# EAGLE design arpie_control_surface (EAGLE 5.10)
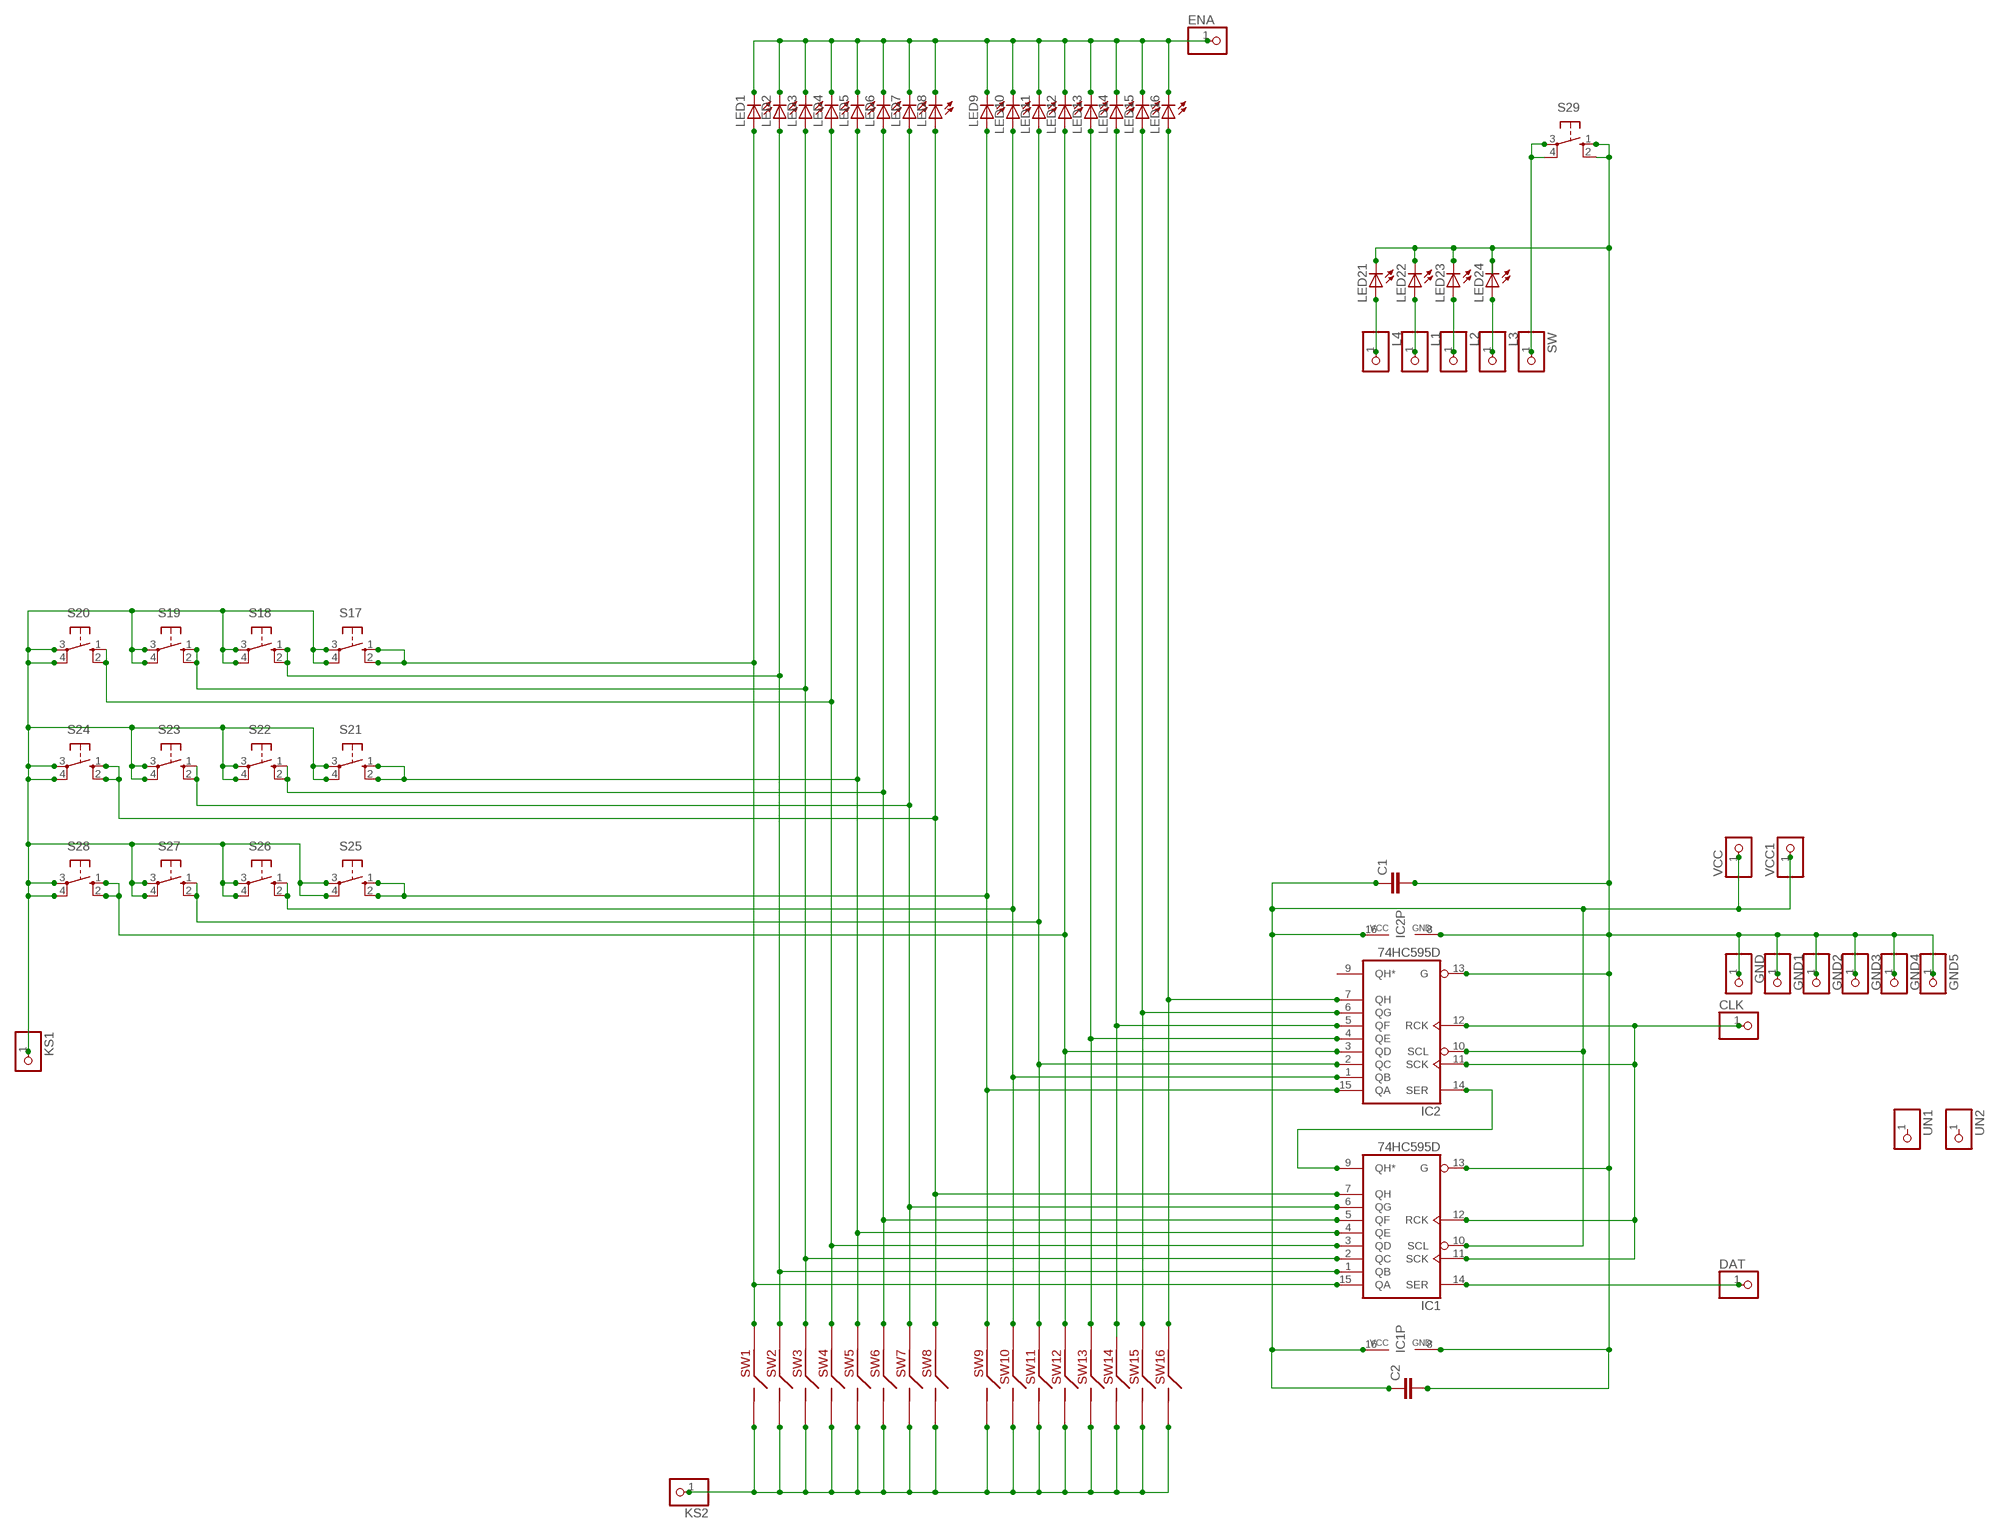
[diagram p0: schematic, sheet 1]

## Parts
C1  C-EUC0805  [C0805]
C2  C-EUC0805  [C0805]
CLK  PINHD-1X1  [1X01]
DAT  PINHD-1X1  [1X01]
ENA  PINHD-1X1  [1X01]
GND  PINHD-1X1  [1X01]
GND1  PINHD-1X1  [1X01]
GND2  PINHD-1X1  [1X01]
GND3  PINHD-1X1  [1X01]
GND4  PINHD-1X1  [1X01]
GND5  PINHD-1X1  [1X01]
IC1  74HC595D  [SO16]
IC2  74HC595D  [SO16]
KS1  PINHD-1X1  [1X01]
KS2  PINHD-1X1  [1X01]
L1  PINHD-1X1  [1X01]
L2  PINHD-1X1  [1X01]
L3  PINHD-1X1  [1X01]
L4  PINHD-1X1  [1X01]
LED1  LED3MM  [LED3MM]
LED2  LED3MM  [LED3MM]
LED3  LED3MM  [LED3MM]
LED4  LED3MM  [LED3MM]
LED5  LED3MM  [LED3MM]
LED6  LED3MM  [LED3MM]
LED7  LED3MM  [LED3MM]
LED8  LED3MM  [LED3MM]
LED9  LED3MM  [LED3MM]
LED10  LED3MM  [LED3MM]
LED11  LED3MM  [LED3MM]
LED12  LED3MM  [LED3MM]
LED13  LED3MM  [LED3MM]
LED14  LED3MM  [LED3MM]
LED15  LED3MM  [LED3MM]
LED16  LED3MM  [LED3MM]
LED21  LED3MM  [LED3MM]
LED22  LED3MM  [LED3MM]
LED23  LED3MM  [LED3MM]
LED24  LED3MM  [LED3MM]
S17  10-XX  [B3F-10XX]
S18  10-XX  [B3F-10XX]
S19  10-XX  [B3F-10XX]
S20  10-XX  [B3F-10XX]
S21  10-XX  [B3F-10XX]
S22  10-XX  [B3F-10XX]
S23  10-XX  [B3F-10XX]
S24  10-XX  [B3F-10XX]
S25  10-XX  [B3F-10XX]
S26  10-XX  [B3F-10XX]
S27  10-XX  [B3F-10XX]
S28  10-XX  [B3F-10XX]
S29  10-XX  [B3F-10XX]
SW  PINHD-1X1  [1X01]
SW1  3MMTACTSW  [3MMTACTSW]
SW2  3MMTACTSW  [3MMTACTSW]
SW3  3MMTACTSW  [3MMTACTSW]
SW4  3MMTACTSW  [3MMTACTSW]
SW5  3MMTACTSW  [3MMTACTSW]
SW6  3MMTACTSW  [3MMTACTSW]
SW7  3MMTACTSW  [3MMTACTSW]
SW8  3MMTACTSW  [3MMTACTSW]
SW9  3MMTACTSW  [3MMTACTSW]
SW10  3MMTACTSW  [3MMTACTSW]
SW11  3MMTACTSW  [3MMTACTSW]
SW12  3MMTACTSW  [3MMTACTSW]
SW13  3MMTACTSW  [3MMTACTSW]
SW14  3MMTACTSW  [3MMTACTSW]
SW15  3MMTACTSW  [3MMTACTSW]
SW16  3MMTACTSW  [3MMTACTSW]
UN1  PINHD-1X1  [1X01]
UN2  PINHD-1X1  [1X01]
VCC  PINHD-1X1  [1X01]
VCC1  PINHD-1X1  [1X01]

## Nets
DAT: DAT.1 IC1.14(SER)
GND: C1.2 C2.2 GND1.1 GND2.1 GND3.1 GND4.1 GND5.1 GND.1 IC1.8(GND) IC1.13(G) IC2.8(GND) IC2.13(G) LED21.K(C) LED22.K(C) LED23.K(C) LED24.K(C) S29.1(S) S29.2(S1)
KEY_SCAN1: KS1.1 S17.3(P) S17.4(P1) S18.3(P) S18.4(P1) S19.3(P) S19.4(P1) S20.3(P) S20.4(P1) S21.3(P) S21.4(P1) S22.3(P) S22.4(P1) S23.3(P) S23.4(P1) S24.3(P) S24.4(P1) S25.3(P) S25.4(P1) S26.3(P) S26.4(P1) S27.3(P) S27.4(P1) S28.3(P) S28.4(P1)
KEY_SCAN2: KS2.1 SW1.P$2 SW2.P$2 SW3.P$2 SW4.P$2 SW5.P$2 SW6.P$2 SW7.P$2 SW8.P$2 SW9.P$2 SW10.P$2 SW11.P$2 SW12.P$2 SW13.P$2 SW14.P$2 SW15.P$2 SW16.P$2
LED1: L1.1 LED22.A
LED2: L2.1 LED23.A
LED3: L3.1 LED24.A
LED4: L4.1 LED21.A
LEDS_ENABLE: ENA.1 LED1.K(C) LED2.K(C) LED3.K(C) LED4.K(C) LED5.K(C) LED6.K(C) LED7.K(C) LED8.K(C) LED9.K(C) LED10.K(C) LED11.K(C) LED12.K(C) LED13.K(C) LED14.K(C) LED15.K(C) LED16.K(C)
N$1: IC1.15(QA) LED1.A S17.1(S) S17.2(S1) SW1.P$1
N$2: IC1.1(QB) LED2.A S18.1(S) S18.2(S1) SW2.P$1
N$3: IC1.2(QC) LED3.A S19.1(S) S19.2(S1) SW3.P$1
N$4: IC1.3(QD) LED4.A S20.1(S) S20.2(S1) SW4.P$1
N$5: IC1.4(QE) LED5.A S21.1(S) S21.2(S1) SW5.P$1
N$6: IC1.5(QF) LED6.A S22.1(S) S22.2(S1) SW6.P$1
N$7: IC1.6(QG) LED7.A S23.1(S) S23.2(S1) SW7.P$1
N$8: IC1.7(QH) LED8.A S24.1(S) S24.2(S1) SW8.P$1
N$9: IC2.15(QA) LED9.A S25.1(S) S25.2(S1) SW9.P$1
N$12: IC2.1(QB) LED10.A S26.1(S) S26.2(S1) SW10.P$1
N$28: IC2.3(QD) LED12.A S28.1(S) S28.2(S1) SW12.P$1
N$30: IC1.9(QH*) IC2.14(SER)
N$35: IC2.4(QE) LED13.A SW13.P$1
N$36: IC2.2(QC) LED11.A S27.1(S) S27.2(S1) SW11.P$1
N$37: IC2.5(QF) LED14.A SW14.P$1
N$38: IC2.6(QG) LED15.A SW15.P$1
N$39: IC2.7(QH) LED16.A SW16.P$1
SCK: CLK.1 IC1.11(SCK) IC1.12(RCK) IC2.11(SCK) IC2.12(RCK)
SWITCH1: S29.3(P) S29.4(P1) SW.1
VCC: C1.1 C2.1 IC1.10(SCL) IC1.16(VCC) IC2.10(SCL) IC2.16(VCC) VCC1.1 VCC.1
Unconnected: IC2.9(QH*) UN1.1 UN2.1

## Library data of the parts
C1 C2 = rcl:C-EU: CAPACITOR, European symbol
CLK DAT ENA GND GND1-GND5 KS1 KS2 L1-L4 SW UN1 UN2 VCC VCC1 = adafruit:PINHD-1X1: Pin header 1x1 for 0.1" spacing With round pins
IC1 IC2 = 74xx-eu:74*595: 8-bit SHIFT REGISTER, output latch
LED1-LED16 LED21-LED24 = adafruit:LED: LED OSRAM: - CHIPLED LG R971, LG N971, LY N971, LG Q971, LY Q971, LO R971, LY R971 LH N974, LH R974 LS Q976, LO Q976, LY Q976 LO Q996 - Hyper CHIPLED LW Q18S LB Q993, LB Q99A, LB R99A - SideLED LS A670, LO A670, LY A670, LG A670, LP A670 LB A673, LV A673, LT A673, LW A673 LH A674 LY A675 LS A676, LA A676, LO A676, LY A676, LW A676 LS A679, LY A679, LG A679 - Hyper Micro SIDELED® LS Y876, LA Y876, LO Y876, LY Y876 LT Y87S - SmartLED LW L88C, LW L88S LB L89C, LB L89S, LG L890 LS L89K, LO L89K, LY L89K LS L896, LA L896, LO L896, LY L896 - TOPLED LS T670, LO T670, LY T670, LG T670, LP T670 LSG T670, LSP T670, LSY T670, LOP T670, LYG T670 LG T671, LOG T671, LSG T671 LB T673, LV T673, LT T673, LW T673 LH T674 LS T676, LA T676, LO T676, LY T676, LB T676, LH T676, LSB T676, LW T676 LB T67C, LV T67C, LT T67C, LS T67K, LO T67K, LY T67K, LW E67C LS E67B, LA E67B, LO E67B, LY E67B, LB E67C, LV E67C, LT E67C LW T67C LS T679, LY T679, LG T679 LS T770, LO T770, LY T770, LG T770, LP T770 LB T773, LV T773, LT T773, LW T773 LH T774 LS E675, LA E675, LY E675, LS T675 LS T776, LA T776, LO T776, LY T776, LB T776 LHGB T686 LT T68C, LB T68C - Hyper Mini TOPLED® LB M676 - Mini TOPLED Santana® LG M470 LS M47K, LO M47K, LY M47K Source: http://www.osram.convergy.de/
S17-S29 = switch-omron:10-XX: OMRON SWITCH
SW1-SW16 = jasons_stuff:3MMTACTSW

## Board
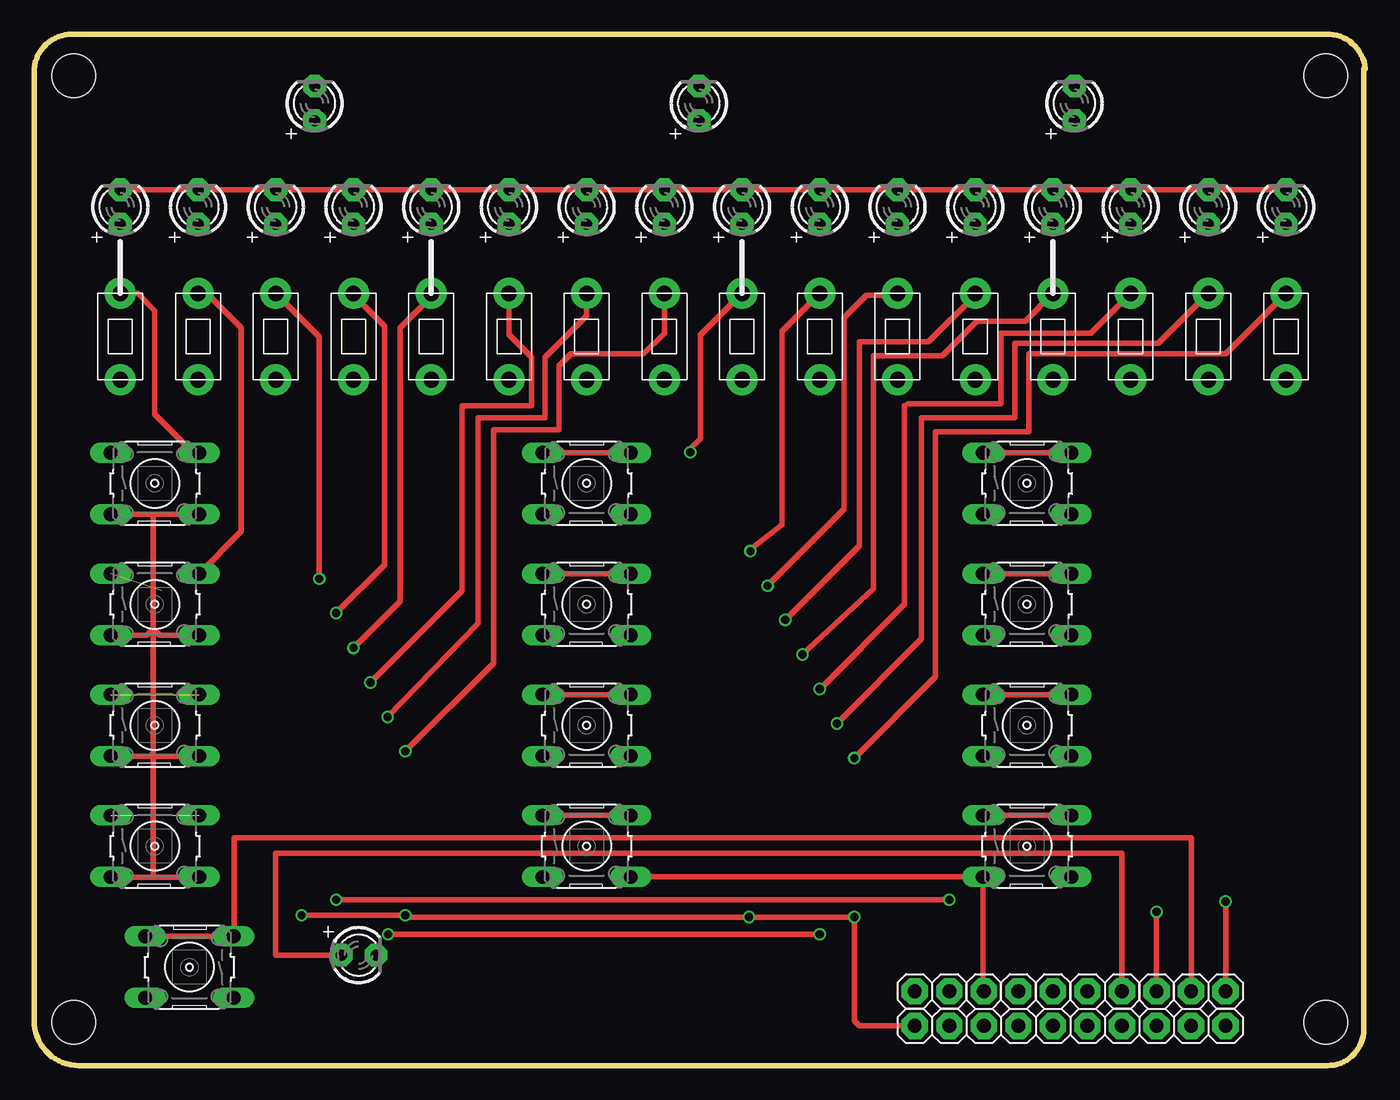
[diagram p1: board, top side]
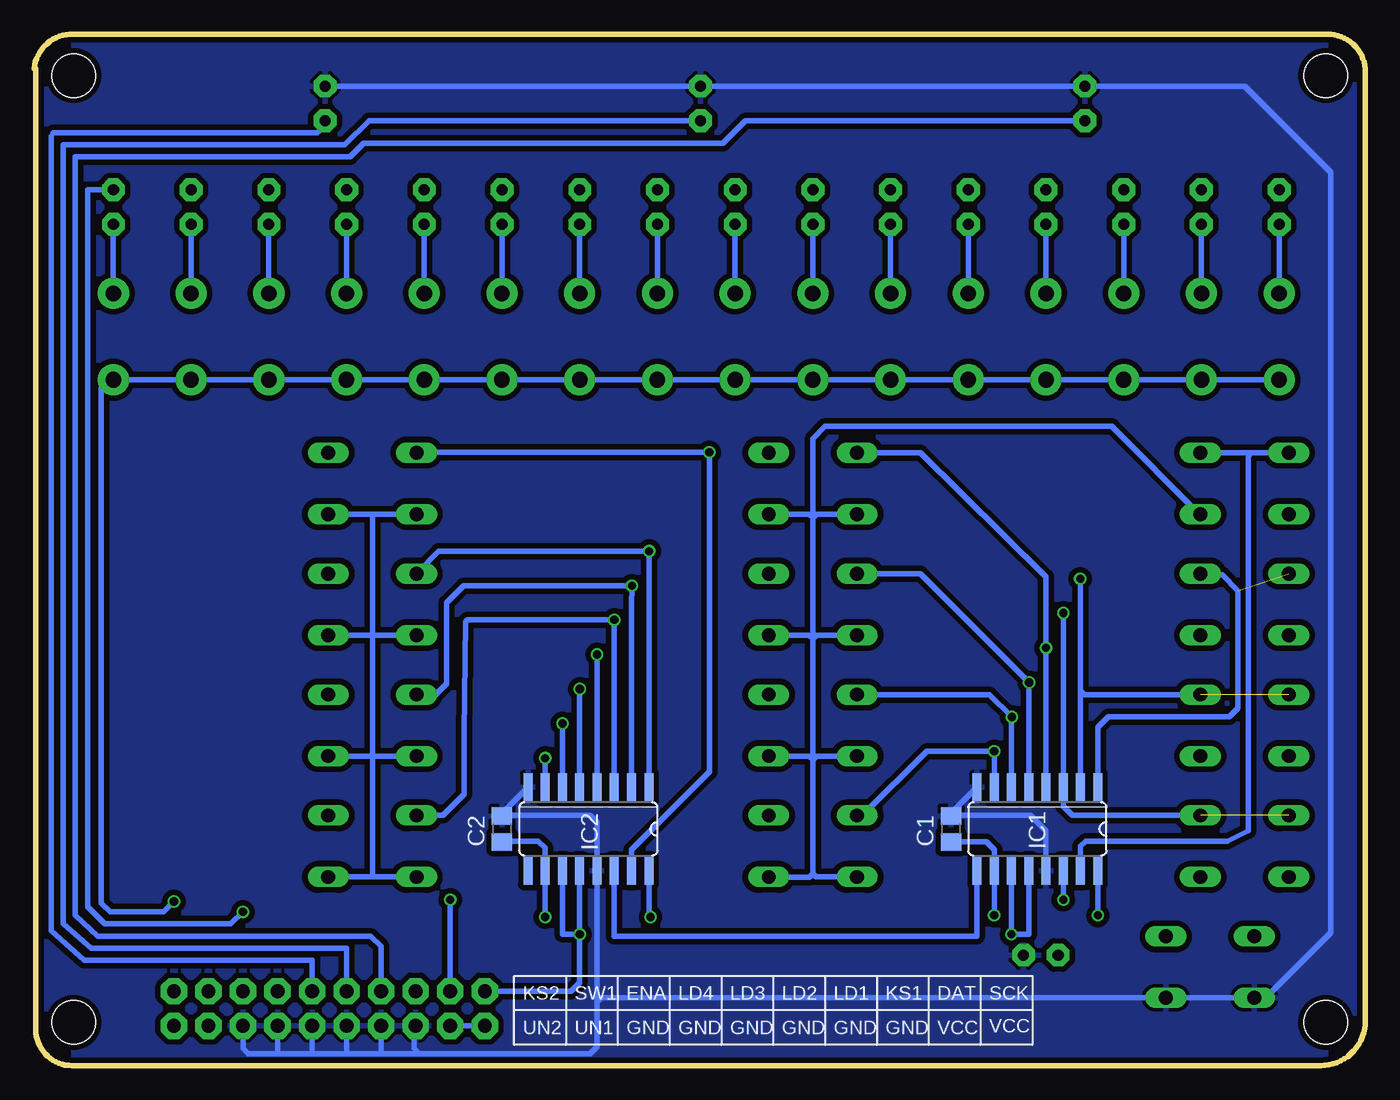
[diagram p2: board, bottom side, seen from below]

Size 97.92 x 75.84 mm. Coordinates in mm from the lower left corner, seen from the top.
Outline: 97.92,73.28 arc90 94.74,75.82 2.79,75.82 arc90 0,73.03 0,3.3 arc90 3.3,0 95.12,0 arc90 97.79,2.67 97.79,73.28
Copper layers (1*16): Top 0.035mm / dielectric 1.5mm / Bottom 0.035mm
Design rules "ITEADstudio_DRC": minimum track width 6mil, minimum drill 12mil, track to track 6mil, track to pad 6mil, pad to pad 6mil, via to via 6mil, smd to smd 0mil, copper to edge 10mil, drill to drill 10mil, minimum pad ring 10mil, minimum via ring 6mil, stop-mask expansion 2mil, vias tented up to drill 100mil, thermal gap 10mil
Holes 3.2 mm at 2.92,72.77 2.92,3.17 95,72.77 95,3.17

### Footprints (pad centres in the part's own frame; a part is rotated, then mirrored left to right if it is on the bottom)
C0805 = smd 1.3 x 1.5: 1 -0.95,0; 2 0.95,0
1X01 = drill 1.016 pad 1.93 octagon: 1 0,0
SO16 = smd 0.66 x 2.032: 1 -4.445,-3.073; 2 -3.175,-3.073; 3 -1.905,-3.073; 4 -0.635,-3.073; 5 0.635,-3.073; 6 1.905,-3.073; 7 3.175,-3.073; 8 4.445,-3.073; 9 4.445,3.073; 10 3.175,3.073; 11 1.905,3.073; 12 0.635,3.073; 13 -0.635,3.073; 14 -1.905,3.073; 15 -3.175,3.073; 16 -4.445,3.073
LED3MM = drill 0.813 pad 1.676 octagon: A -1.27,0; K 1.27,0
B3F-10XX = drill 1.016 long: 1 -3.251,2.261; 2 3.251,2.261; 3 -3.251,-2.261; 4 3.251,-2.261
3MMTACTSW = drill 1.143 pad 2.286 round: P$1 0,2.54; P$2 0,-3.81

### Placement (x,y rotation side)
C1  30.48,17.4 90 bottom
C2  63.5,17.4 90 bottom
CLK  64.77,5.46 0 top
DAT  67.31,5.46 0 top
ENA  82.55,5.46 90 top
GND  80.01,2.92 0 top
GND1  82.55,2.92 0 top
GND2  77.47,2.92 0 top
GND3  74.93,2.92 0 top
GND4  72.39,2.92 0 top
GND5  69.85,2.92 0 top
IC1  24.13,17.4 180 bottom
IC2  57.15,17.4 180 bottom
KS1  69.85,5.46 90 top
KS2  87.63,5.46 0 top
L1  72.39,5.46 90 top
L2  74.93,5.46 90 top
L3  77.47,5.46 90 top
L4  80.01,5.46 0 top
LED1  6.35,63.12 90 top
LED2  12.06,63.12 90 top
LED3  17.78,63.12 90 top
LED4  23.5,63.12 90 top
LED5  29.21,63.12 90 top
LED6  34.93,63.12 90 top
LED7  40.64,63.12 90 top
LED8  46.36,63.12 90 top
LED9  52.07,63.12 90 top
LED10  57.79,63.12 90 top
LED11  63.5,63.12 90 top
LED12  69.21,63.12 90 top
LED13  74.93,63.12 90 top
LED14  80.64,63.12 90 top
LED15  86.36,63.12 90 top
LED16  92.08,63.12 90 top
LED21  23.88,8.13 0 top
LED22  20.64,70.74 90 top
LED23  48.9,70.74 90 top
LED24  76.52,70.74 90 top
S17  8.89,42.8 0 top
S18  8.89,33.91 0 top
S19  8.89,25.02 0 top
S20  8.89,16.13 0 top
S21  40.64,42.8 0 top
S22  40.64,33.91 0 top
S23  40.64,25.02 0 top
S24  40.64,16.13 0 top
S25  73.02,42.8 0 top
S26  73.02,33.91 0 top
S27  73.02,25.02 0 top
S28  73.02,16.13 0 top
S29  11.43,7.24 180 top
SW  85.09,5.46 90 top
SW1  6.35,54.23 0 top
SW2  12.06,54.23 0 top
SW3  17.78,54.23 0 top
SW4  23.5,54.23 0 top
SW5  29.21,54.23 0 top
SW6  34.93,54.23 0 top
SW7  40.64,54.23 0 top
SW8  46.36,54.23 0 top
SW9  52.07,54.23 0 top
SW10  57.79,54.23 0 top
SW11  63.5,54.23 0 top
SW12  69.21,54.23 0 top
SW13  74.93,54.23 0 top
SW14  80.64,54.23 0 top
SW15  86.36,54.23 0 top
SW16  92.08,54.23 0 top
UN1  85.09,2.92 0 top
UN2  87.63,2.92 0 top
VCC  64.77,2.92 0 top
VCC1  67.31,2.92 0 top

### Tracks (layer width: path | path; a pad name or v marks a point on that pad's centre or on a via)
DAT  (via drill 0.6)
  Top 0.406: v22.22,12.19 v67.31,12.19
  Bottom 0.406: v22.22,12.19 IC1.14 | v67.31,12.19 DAT.1
GND
  Bottom 0.406: LED24.K LED23.K LED22.K 8.89,72.01 2.54,65.66 2.54,9.78 7.62,4.7 7.9,4.7 S29.2 S29.1 56.24,4.98 56.52,4.7 | 30.41,18.41 C1.2 | 30.41,18.41 24.64,18.41 23.5,17.27 IC1.13 | 30.41,18.41 30.41,18.63 IC1.8 | IC2.8 63.5,18.57 C2.2 63.43,18.41 57.02,18.41 56.52,17.91 IC2.13 56.52,4.7 | 69.6,0.89 57.02,0.89 56.52,1.4 56.52,4.7 | GND5.1 69.98,2.79 69.98,1.27 69.6,0.89 | 69.6,0.89 72.39,0.89 | 72.39,0.89 74.93,0.89 | 74.93,0.89 77.47,0.89 | 77.47,0.89 80.01,0.89 | 80.01,0.89 82.17,0.89 82.55,1.27 GND1.1 | 80.01,0.89 GND.1 | 77.47,0.89 GND2.1 | 74.93,0.89 GND3.1 | 72.39,0.89 GND4.1
  pour Bottom (isolate 0.406): 2.92,0.51 95,0.51 95,3.05 97.28,3.05 97.28,3.17 97.41,3.17 97.41,72.77 95,72.77 95,75.31 2.92,75.31 2.92,72.77 0.51,72.77 0.51,3.17 2.92,3.17
KEY_SCAN1
  Top 0.406: S17.3 S17.4 8.79,40.54 8.76,40.51 8.76,32.13 | 8.76,13.84 8.76,22.61 | 8.76,22.61 8.76,22.99 | 8.76,22.99 8.76,32.13 | 8.76,13.84 5.66,13.84 S20.3 | 8.76,13.84 12.12,13.84 S20.4 | S19.3 8.53,22.76 8.76,22.99 | S19.4 8.91,22.76 8.76,22.61 | S18.3 8.28,31.65 8.76,32.13 | S18.4 9.25,31.65 8.76,32.13 | S24.4 S28.3 69.77,5.54 KS1.1
  Bottom 0.406: S17.4 12.22,40.54 18.67,46.99 39.75,46.99 40.64,46.1 40.64,40.26 | S25.3 S25.4 73.05,40.54 73.02,40.51 73.02,31.75 | 73.02,31.65 S26.3 | 73.02,31.65 S26.4 73.13,31.65 73.02,31.75 | 73.15,22.76 S27.3 | 73.15,22.76 S27.4 73.05,22.76 73.02,22.73 73.02,14 72.9,13.87 | S28.3 72.9,13.87 | 72.9,13.87 S28.4 | 73.02,31.65 73.02,31.75 | 73.02,31.65 73.02,22.88 73.15,22.76 | 40.64,40.26 40.64,31.37 | 40.64,31.37 40.64,22.48 | 40.64,22.48 40.64,14.1 | 40.64,14.1 40.89,13.84 43.87,13.84 S24.4 | S24.3 40.41,13.87 40.64,14.1 | S23.3 40.36,22.76 40.64,22.48 | S23.4 40.92,22.76 40.64,22.48 | S22.3 40.36,31.65 40.64,31.37 | S22.4 40.92,31.65 40.64,31.37 | S21.3 40.36,40.54 40.64,40.26 | S21.4 40.92,40.54 40.64,40.26
KEY_SCAN2  (via drill 0.6)
  Top 0.406: v87.63,12.07 KS2.1
  Bottom 0.406: SW1.P$2 SW2.P$2 SW3.P$2 SW4.P$2 SW5.P$2 SW6.P$2 SW7.P$2 SW8.P$2 SW9.P$2 SW10.P$2 SW11.P$2 SW12.P$2 SW13.P$2 SW14.P$2 SW15.P$2 | SW15.P$2 SW16.P$2 | SW15.P$2 92.2,50.42 92.33,50.29 | SW15.P$2 92.33,50.42 92.96,49.78 92.96,11.94 92.33,11.3 88.39,11.3 v87.63,12.07
LED1
  Bottom 0.406: LED22.A 45.59,69.47 47.24,67.82 73.66,67.82 74.68,66.8 94.87,66.8 94.87,11.05 93.22,9.52 73.15,9.52 72.39,8.76 L1.1
LED2
  Bottom 0.406: LED23.A 73.28,69.47 75.06,67.69 95.76,67.69 95.76,10.41 93.73,8.64 74.93,8.64 L2.1
LED3
  Bottom 0.406: LED24.A 76.52,69.02 77.09,68.58 96.52,68.58 96.65,68.33 96.65,9.91 94.23,7.75 77.47,7.75 L3.1
LED4
  Top 0.406: L4.1 80.01,15.62 17.78,15.62 17.75,8.13 LED21.A
LEDS_ENABLE  (via drill 0.6)
  Top 0.406: LED1.K LED2.K LED3.K | LED3.K 19.05,64.39 | LED4.K 24.13,64.39 | LED3.K LED4.K | LED4.K LED5.K LED6.K LED7.K LED8.K LED9.K LED10.K LED11.K LED12.K LED13.K LED14.K | LED14.K LED15.K LED16.K LED14.K | v82.55,11.3 ENA.1
  Bottom 0.406: LED16.K 93.98,64.39 93.98,11.68 92.71,10.41 83.44,10.41 v82.55,11.3
N$1
  Top 0.406: SW1.P$1 7.62,56.77 8.89,55.5 8.89,47.88 11.43,45.34 11.73,45.09 S17.2
  Bottom 0.406: SW1.P$1 LED1.A | IC1.15 20.95,16.13 20.57,16.51 10.16,16.51 8.64,17.27 8.64,44.81 8.38,45.06 | 8.38,45.06 S17.1 | 8.38,45.06 S17.2
N$2  (1 unrouted)
  Top 0.406: SW2.P$1 12.7,56.77 15.24,54.23 15.24,39.27 S18.2
  Bottom 0.406: SW2.P$1 LED2.A | IC1.1 19.68,24.89 18.92,25.65 10.03,25.65 9.4,26.29 9.4,34.92 10.54,36.07 12.04,36.07 S18.2
N$3  (via drill 0.6)  (1 unrouted)
  Top 0.406: SW3.P$1 19.05,55.5 20.32,54.23 20.98,53.57 v20.98,35.79
  Bottom 0.406: SW3.P$1 LED3.A | 20.96,27.56 20.95,26.67 IC1.2 | 20.96,27.56 v20.98,35.79 | S19.2 20.68,27.28 20.96,27.56
N$4  (via drill 0.6)  (1 unrouted)
  Top 0.406: v22.22,33.27 25.78,36.83 25.78,54.36 23.5,56.64 SW4.P$1
  Bottom 0.406: SW4.P$1 LED4.A | S20.2 21.57,18.39 22.22,19.05 IC1.3 v22.22,33.27
N$5  (via drill 0.6)
  Top 0.406: v23.5,30.71 26.92,34.14 26.92,54.23 29.21,56.52 SW5.P$1 | S21.1 S21.2
  Bottom 0.406: SW5.P$1 LED5.A | IC1.4 v23.5,30.71 23.5,35.94 32.74,45.06 S21.1
N$6  (via drill 0.6)
  Top 0.406: SW6.P$1 34.93,53.72 36.58,52.07 36.58,48.51 31.5,48.51 31.5,34.92 v24.74,28.17 | S22.1 S22.2
  Bottom 0.406: SW6.P$1 LED6.A | IC1.5 24.77,28.14 v24.74,28.17 32.74,36.17 S22.1
N$7  (via drill 0.6)
  Top 0.406: SW7.P$1 40.64,55.12 37.59,52.07 37.59,47.62 32.64,47.62 32.64,32.51 v26.01,25.63 | S23.1 S23.2
  Bottom 0.406: SW7.P$1 LED7.A | IC1.6 26.04,25.6 v26.01,25.63 27.66,27.28 S23.1
N$8  (via drill 0.6)
  Top 0.406: v27.3,23.11 33.78,29.59 33.78,46.74 38.61,46.74 38.61,51.44 39.5,52.32 44.83,52.32 46.36,53.85 SW8.P$1 | S24.1 S24.2
  Bottom 0.406: SW8.P$1 LED8.A | S24.1 36.98,18.39 32.26,23.11 v27.3,23.11 IC1.7
N$9  (via drill 0.6)
  Top 0.406: v48.26,45.09 48.26,45.34 49.02,46.1 49.02,53.72 SW9.P$1 | S25.1 S25.2
  Bottom 0.406: SW9.P$1 LED9.A | S25.1 69.75,45.09 v48.26,45.09 48.26,21.59 53.98,15.88 IC2.15
N$12  (via drill 0.6)
  Top 0.406: v52.68,37.82 52.68,37.95 54.99,39.75 54.99,53.98 SW10.P$1 | S26.1 S26.2
  Bottom 0.406: SW10.P$1 LED10.A | IC2.1 52.71,37.8 | 52.71,37.8 v52.68,37.82 | 52.71,37.8 68.15,37.8 S26.1
N$28  (via drill 0.6)
  Top 0.406: SW12.P$1 69.21,56.64 65.79,53.21 60.71,53.21 60.71,38.23 v55.25,32.77 | S28.1 S28.2
  Bottom 0.406: SW12.P$1 LED12.A | S28.1 67.84,18.39 66.29,19.94 66.29,24.38 66.17,32.64 66.05,32.77 v55.25,32.77 IC2.3
N$30
  Bottom 0.406: IC1.9 28.57,9.52 55.25,9.52 IC2.14
N$35  (via drill 0.6)
  Top 0.406: SW13.P$1 72.9,54.74 69.34,54.74 66.8,52.2 61.72,52.2 61.72,35.05 v56.52,30.23
  Bottom 0.406: SW13.P$1 LED13.A | IC2.4 v56.52,30.23
N$36  (via drill 0.6)
  Top 0.406: 63.5,56.64 SW11.P$1 63.37,56.64 61.21,56.64 59.56,54.99 59.56,40.89 v53.95,35.28 | S27.1 S27.2
  Bottom 0.406: SW11.P$1 LED11.A | IC2.2 53.98,33.78 v53.95,35.28 66.32,35.28 67.56,34.04 67.56,28.07 68.45,27.18 69.67,27.18 S27.1
N$37  (via drill 0.6)
  Top 0.406: SW14.P$1 77.72,53.85 71.12,53.85 71.12,48.64 64.26,48.64 64.01,48.51 64.01,33.91 v57.79,27.69
  Bottom 0.406: SW14.P$1 LED14.A | IC2.5 v57.79,27.69
N$38  (via drill 0.6)
  Top 0.406: SW15.P$1 82.68,53.09 72.14,53.09 72.14,47.62 65.28,47.62 65.28,31.37 v59.05,25.15
  Bottom 0.406: SW15.P$1 LED15.A | IC2.6 v59.05,25.15
N$39  (via drill 0.6)
  Top 0.406: SW16.P$1 87.63,52.32 73.15,52.32 73.15,46.61 66.29,46.61 66.29,28.57 v60.33,22.61
  Bottom 0.406: SW16.P$1 LED16.A | IC2.7 v60.33,22.61
SCK  (via drill 0.6)
  Top 0.406: v26.04,9.65 v57.79,9.65
  Bottom 0.406: IC1.11 v26.04,9.65 24.77,9.65 IC1.12 | v57.79,9.65 IC2.12 | IC2.11 59.05,9.65 v57.79,9.65 | CLK.1 58.42,5.46 57.79,6.1 v57.79,9.65
SWITCH1
  Top 0.406: SW.1 85.09,16.76 14.73,16.76 14.73,9.5 S29.3 S29.4
VCC  (via drill 0.6)
  Top 0.406: v19.68,11.05 v27.3,11.05 27.43,10.92 v52.58,10.92 v60.33,10.92 60.33,3.3 60.71,2.92 VCC.1
  Bottom 0.406: C1.1 27.88,16.45 27.3,15.88 IC1.10 v27.3,11.05 | IC2.10 60.33,16 60.83,16.51 63.44,16.51 C2.1 | v19.68,11.05 IC1.16 | VCC.1 VCC1.1 | IC2.10 60.33,11.18 v60.33,10.92 | IC2.10 60.33,11.81 | IC2.16 52.71,11.05 v52.58,10.92

### Text on the board
bPlace: SCK | DAT | KS1 | LD1 | LD2 | LD3 | LD4 | ENA | SW1 | KS2 | VCC | VCC | GND | GND | GND | GND | GND | GND | UN1 | UN2
bDocu: ARPIE MIDI arpeggiator control surface pcb rev 2 | hotchk155